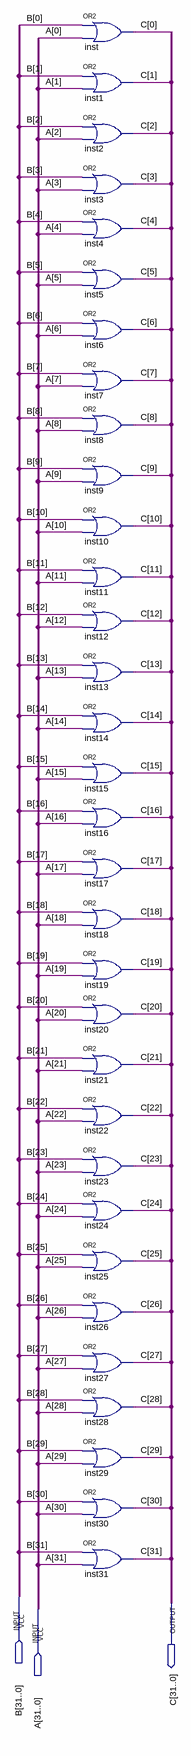
[diagram p0: schematic sheet]
// Quartus schematic logical_or.bdf as structural Verilog: 32 symbols, 3 pins
module logical_or (
  input  [31:0] B,
  input  [31:0] A,
  output [31:0] C
);

  or inst (C[0], B[0], A[0]);
  or inst1 (C[1], B[1], A[1]);
  or inst2 (C[2], B[2], A[2]);
  or inst3 (C[3], B[3], A[3]);
  or inst4 (C[4], B[4], A[4]);
  or inst5 (C[5], B[5], A[5]);
  or inst6 (C[6], B[6], A[6]);
  or inst7 (C[7], B[7], A[7]);
  or inst8 (C[8], B[8], A[8]);
  or inst9 (C[9], B[9], A[9]);
  or inst10 (C[10], B[10], A[10]);
  or inst11 (C[11], B[11], A[11]);
  or inst12 (C[12], B[12], A[12]);
  or inst13 (C[13], B[13], A[13]);
  or inst14 (C[14], B[14], A[14]);
  or inst15 (C[15], B[15], A[15]);
  or inst16 (C[16], B[16], A[16]);
  or inst17 (C[17], B[17], A[17]);
  or inst18 (C[18], B[18], A[18]);
  or inst19 (C[19], B[19], A[19]);
  or inst20 (C[20], B[20], A[20]);
  or inst21 (C[21], B[21], A[21]);
  or inst22 (C[22], B[22], A[22]);
  or inst23 (C[23], B[23], A[23]);
  or inst24 (C[24], B[24], A[24]);
  or inst25 (C[25], B[25], A[25]);
  or inst26 (C[26], B[26], A[26]);
  or inst27 (C[27], B[27], A[27]);
  or inst28 (C[28], B[28], A[28]);
  or inst29 (C[29], B[29], A[29]);
  or inst30 (C[30], B[30], A[30]);
  or inst31 (C[31], B[31], A[31]);
endmodule
